# EAGLE design mainboard (EAGLE 8.3.2)
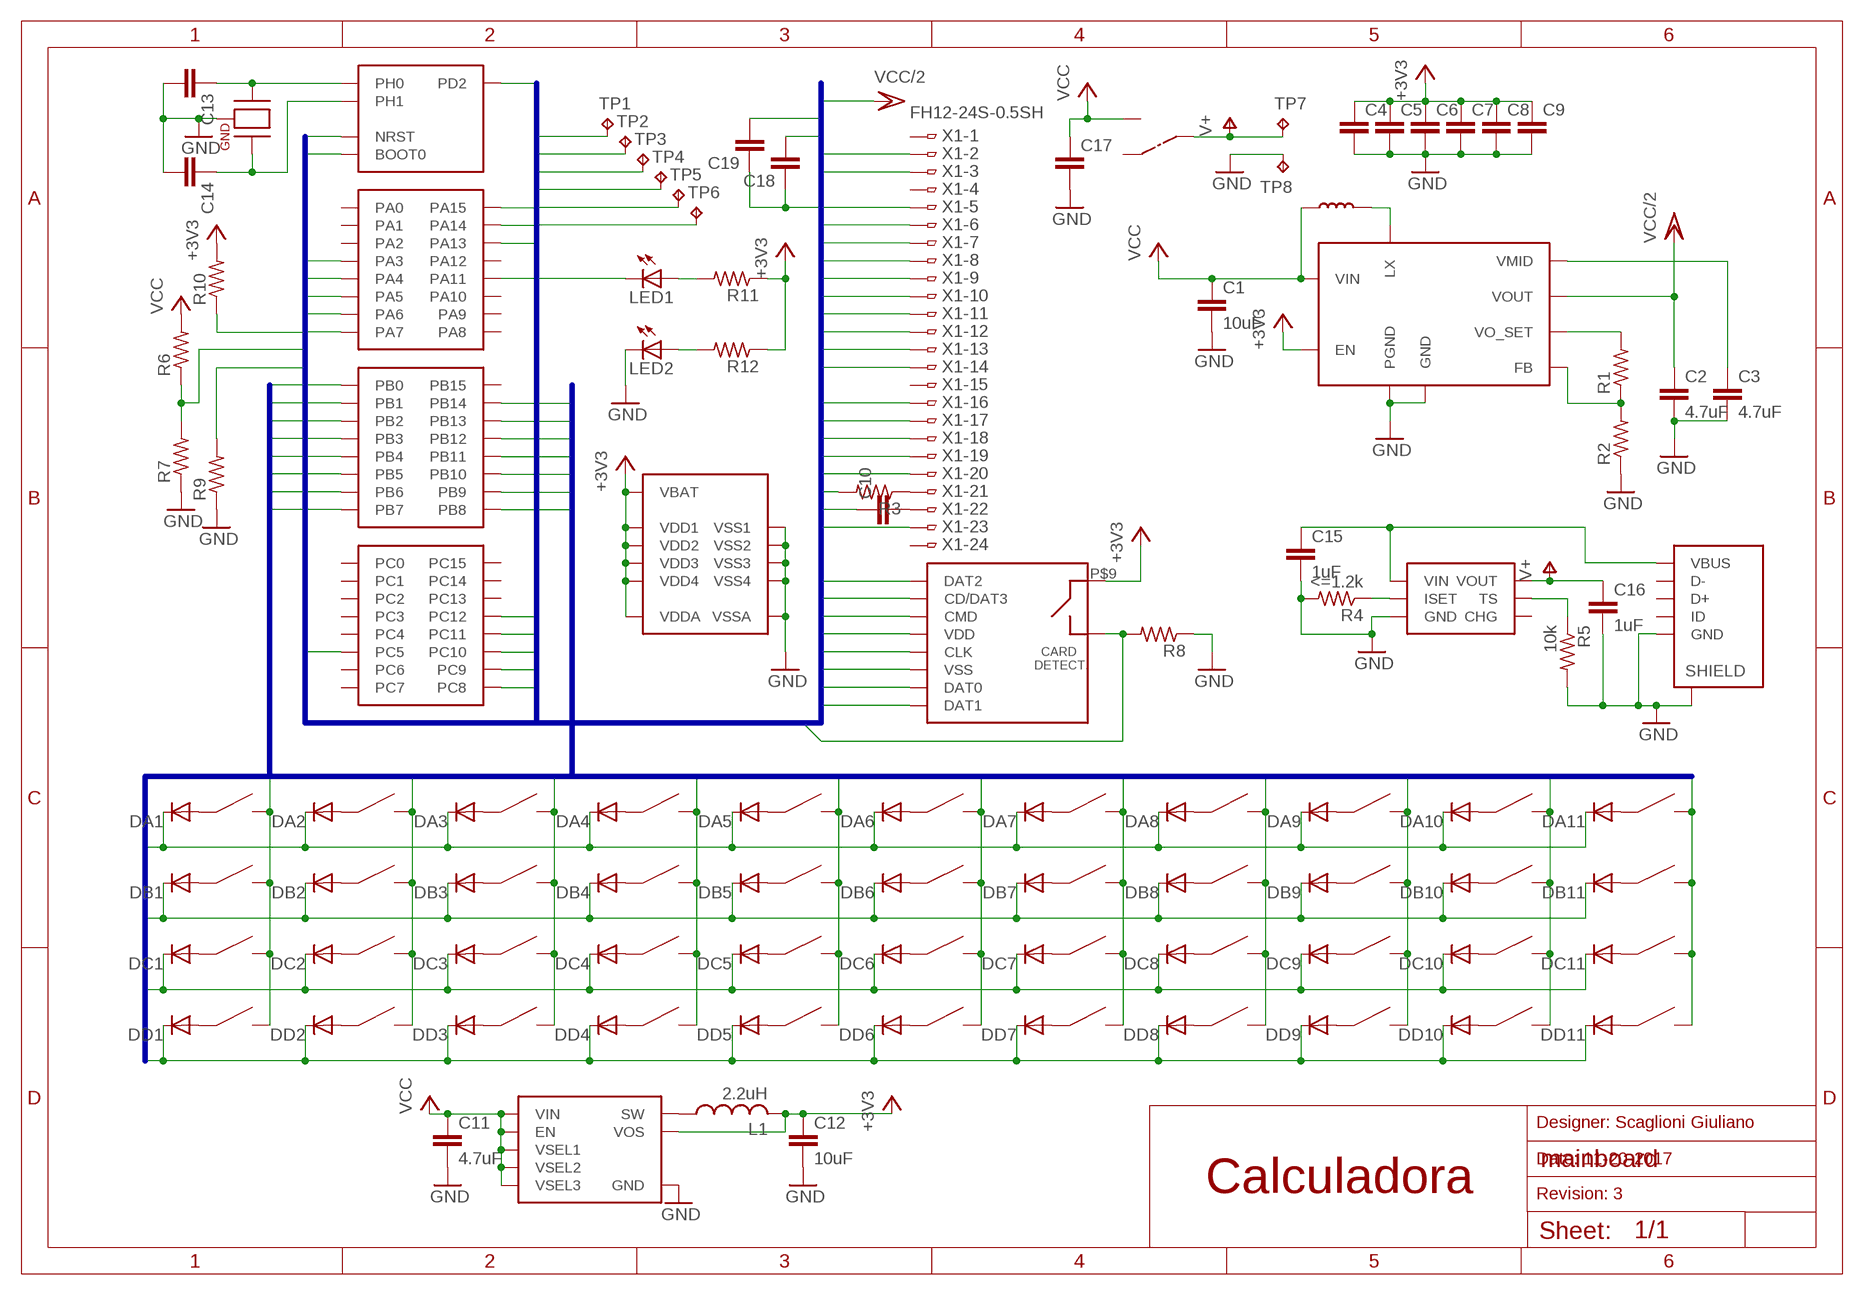
[diagram p0: schematic, sheet 1]

## Parts
BTA1  WURTH_SWITCH  [WURTH_SWITCH_SMD]
BTA2  WURTH_SWITCH  [WURTH_SWITCH_SMD]
BTA3  WURTH_SWITCH  [WURTH_SWITCH_SMD]
BTA4  WURTH_SWITCH  [WURTH_SWITCH_SMD]
BTA5  WURTH_SWITCH  [WURTH_SWITCH_SMD]
BTA6  WURTH_SWITCH  [WURTH_SWITCH_SMD]
BTA7  WURTH_SWITCH  [WURTH_SWITCH_SMD]
BTA8  WURTH_SWITCH  [WURTH_SWITCH_SMD]
BTA9  WURTH_SWITCH  [WURTH_SWITCH_SMD]
BTA10  WURTH_SWITCH  [WURTH_SWITCH_SMD]
BTA11  WURTH_SWITCH  [WURTH_SWITCH_SMD]
BTB1  WURTH_SWITCH  [WURTH_SWITCH_SMD]
BTB2  WURTH_SWITCH  [WURTH_SWITCH_SMD]
BTB3  WURTH_SWITCH  [WURTH_SWITCH_SMD]
BTB4  WURTH_SWITCH  [WURTH_SWITCH_SMD]
BTB5  WURTH_SWITCH  [WURTH_SWITCH_SMD]
BTB6  WURTH_SWITCH  [WURTH_SWITCH_SMD]
BTB7  WURTH_SWITCH  [WURTH_SWITCH_SMD]
BTB8  WURTH_SWITCH  [WURTH_SWITCH_SMD]
BTB9  WURTH_SWITCH  [WURTH_SWITCH_SMD]
BTB10  WURTH_SWITCH  [WURTH_SWITCH_SMD]
BTB11  WURTH_SWITCH  [WURTH_SWITCH_SMD]
BTC1  WURTH_SWITCH  [WURTH_SWITCH_SMD]
BTC2  WURTH_SWITCH  [WURTH_SWITCH_SMD]
BTC3  WURTH_SWITCH  [WURTH_SWITCH_SMD]
BTC4  WURTH_SWITCH  [WURTH_SWITCH_SMD]
BTC5  WURTH_SWITCH  [WURTH_SWITCH_SMD]
BTC6  WURTH_SWITCH  [WURTH_SWITCH_SMD]
BTC7  WURTH_SWITCH  [WURTH_SWITCH_SMD]
BTC8  WURTH_SWITCH  [WURTH_SWITCH_SMD]
BTC9  WURTH_SWITCH  [WURTH_SWITCH_SMD]
BTC10  WURTH_SWITCH  [WURTH_SWITCH_SMD]
BTC11  WURTH_SWITCH  [WURTH_SWITCH_SMD]
BTD1  WURTH_SWITCH  [WURTH_SWITCH_SMD]
BTD2  WURTH_SWITCH  [WURTH_SWITCH_SMD]
BTD3  WURTH_SWITCH  [WURTH_SWITCH_SMD]
BTD4  WURTH_SWITCH  [WURTH_SWITCH_SMD]
BTD5  WURTH_SWITCH  [WURTH_SWITCH_SMD]
BTD6  WURTH_SWITCH  [WURTH_SWITCH_SMD]
BTD7  WURTH_SWITCH  [WURTH_SWITCH_SMD]
BTD8  WURTH_SWITCH  [WURTH_SWITCH_SMD]
BTD9  WURTH_SWITCH  [WURTH_SWITCH_SMD]
BTD10  WURTH_SWITCH  [WURTH_SWITCH_SMD]
BTD11  WURTH_SWITCH  [WURTH_SWITCH_SMD]
C1  10uF  C-EUC0805  [C0805]
C2  4.7uF  C-EUC0805  [C0805]
C3  4.7uF  C-EUC0805  [C0805]
C4  C-EUC0603  [C0603]
C5  C-EUC0603  [C0603]
C6  C-EUC0603  [C0603]
C7  C-EUC0603  [C0603]
C8  C-EUC0603  [C0603]
C9  C-EUC0603  [C0603]
C10  C-EUC0603  [C0603]
C11  4.7uF  C-EUC0603  [C0603]
C12  10uF  C-EUC0603  [C0603]
C13  CC0603  [C0603]
C14  CC0603  [C0603]
C15  1uF  C-EUC0603  [C0603]
C16  1uF  C-EUC0603  [C0603]
C17  CC1206  [C1206]
C18  C-EUC0603  [C0603]
C19  C-EUC0603  [C0603]
DA1  DIODE-SOD523  [SOD523]
DA2  DIODE-SOD523  [SOD523]
DA3  DIODE-SOD523  [SOD523]
DA4  DIODE-SOD523  [SOD523]
DA5  DIODE-SOD523  [SOD523]
DA6  DIODE-SOD523  [SOD523]
DA7  DIODE-SOD523  [SOD523]
DA8  DIODE-SOD523  [SOD523]
DA9  DIODE-SOD523  [SOD523]
DA10  DIODE-SOD523  [SOD523]
DA11  DIODE-SOD523  [SOD523]
DB1  DIODE-SOD523  [SOD523]
DB2  DIODE-SOD523  [SOD523]
DB3  DIODE-SOD523  [SOD523]
DB4  DIODE-SOD523  [SOD523]
DB5  DIODE-SOD523  [SOD523]
DB6  DIODE-SOD523  [SOD523]
DB7  DIODE-SOD523  [SOD523]
DB8  DIODE-SOD523  [SOD523]
DB9  DIODE-SOD523  [SOD523]
DB10  DIODE-SOD523  [SOD523]
DB11  DIODE-SOD523  [SOD523]
DC1  DIODE-SOD523  [SOD523]
DC2  DIODE-SOD523  [SOD523]
DC3  DIODE-SOD523  [SOD523]
DC4  DIODE-SOD523  [SOD523]
DC5  DIODE-SOD523  [SOD523]
DC6  DIODE-SOD523  [SOD523]
DC7  DIODE-SOD523  [SOD523]
DC8  DIODE-SOD523  [SOD523]
DC9  DIODE-SOD523  [SOD523]
DC10  DIODE-SOD523  [SOD523]
DC11  DIODE-SOD523  [SOD523]
DD1  DIODE-SOD523  [SOD523]
DD2  DIODE-SOD523  [SOD523]
DD3  DIODE-SOD523  [SOD523]
DD4  DIODE-SOD523  [SOD523]
DD5  DIODE-SOD523  [SOD523]
DD6  DIODE-SOD523  [SOD523]
DD7  DIODE-SOD523  [SOD523]
DD8  DIODE-SOD523  [SOD523]
DD9  DIODE-SOD523  [SOD523]
DD10  DIODE-SOD523  [SOD523]
DD11  DIODE-SOD523  [SOD523]
L1  2.2uH  L-USL2012C  [L2012C]
LED1  LED_ESML0603  [LED_SML0603]
LED2  LED_ESML0603  [LED_SML0603]
R1  R-US_R0402  [R0402]
R2  R-US_R0402  [R0402]
R3  R-US_R0402  [R0402]
R4  <=1.2k  R-US_R0402  [R0402]
R5  10k  R-US_R0402  [R0402]
R6  R-US_R0402  [R0402]
R7  R-US_R0402  [R0402]
R8  R-US_R0402  [R0402]
R9  R-US_R0402  [R0402]
R10  R-US_R0402  [R0402]
R11  R-US_R0402  [R0402]
R12  R-US_R0402  [R0402]
TP1  TPTP20SQ  [TP20SQ]
TP2  TPTP20SQ  [TP20SQ]
TP3  TPTP20SQ  [TP20SQ]
TP4  TPTP20SQ  [TP20SQ]
TP5  TPTP20SQ  [TP20SQ]
TP6  TPTP20SQ  [TP20SQ]
TP7  TPTP20SQ  [TP20SQ]
TP8  TPTP20SQ  [TP20SQ]
U$1  STM32L471RGT6  [LQFP64]
U$2  DM3AT-SF-PEJM5  [DM3AT-SF-PEJM5_MICROSDREADER]
U$3  MOLEX_47346-1001  [MOLEX_47346-1001]
U$4  STOD1317BTPUR  [DFN12L]
U$5  VLS252010HBU  [VLS252010HBU]
U$6  TPS627431YFPR  [BGA8]
U$7  CX5032SA  [CRYSTAL_5X3.2]
U$8  BQ21040DBVR  [6-SOT-23]
U$9  ALPS_SSSS810701  [ALPS_SSSS810701]
X1  FH12-24S-0.5SH  [FH12-24S-0.5SH]

## Nets
+3V3: C4.1 C5.1 C6.1 C7.1 C8.1 C9.1 C12.1 C18.2 L1.2 R10.2 R11.1 R12.1 TP1.TP U$1.P$1(VBAT) U$1.P$13(VDDA) U$1.P$19(VDD1) U$1.P$32(VDD2) U$1.P$48(VDD3) U$1.P$64(VDD4) U$2.P$4(VDD) U$2.P$9 U$4.P6(EN) U$6.C2(VOS) X1.5 X1.9
BAT_SENS: R6.1 R7.2 U$1.P$25(PC5)
BOOT0: R9.2 TP5.TP U$1.P$60(BOOT0)
GND: C1.2 C2.2 C3.2 C4.2 C5.2 C6.2 C7.2 C8.2 C9.2 C10.1 C11.2 C12.2 C13.2 C14.2 C15.2 C16.2 C17.2 C18.1 C19.1 LED2.C R2.1 R3.2 R4.2 R5.2 R7.1 R8.1 R9.1 TP4.TP TP8.TP U$1.P$12(VSSA) U$1.P$18(VSS1) U$1.P$31(VSS2) U$1.P$47(VSS3) U$1.P$63(VSS4) U$2.P$6(VSS) U$3.MECH1 U$3.MECH2 U$3.MECH3 U$3.MECH4 U$3.MECH5 U$3.MECH6 U$3.P$5(GND) U$4.P4(GND) U$4.P9(PGND) U$4.P10(PGND) U$6.B2(GND) U$7.P$2(GND) U$7.P$4(GND) U$8.P$5(GND) X1.2 X1.3 X1.6 X1.7 X1.11 X1.12 X1.16 X1.17 X1.18 X1.19 X1.20
KEYCOL0: BTA1.P$2 BTA1.P$4 BTB1.P$2 BTB1.P$4 BTC1.P$2 BTC1.P$4 BTD1.P$2 BTD1.P$4 U$1.P$26(PB0)
KEYCOL1: BTA2.P$2 BTA2.P$4 BTB2.P$2 BTB2.P$4 BTC2.P$2 BTC2.P$4 BTD2.P$2 BTD2.P$4 U$1.P$27(PB1)
KEYCOL2: BTA3.P$2 BTA3.P$4 BTB3.P$2 BTB3.P$4 BTC3.P$2 BTC3.P$4 BTD3.P$2 BTD3.P$4 U$1.P$28(PB2)
KEYCOL3: BTA4.P$2 BTA4.P$4 BTB4.P$2 BTB4.P$4 BTC4.P$2 BTC4.P$4 BTD4.P$2 BTD4.P$4 U$1.P$55(PB3)
KEYCOL4: BTA5.P$2 BTA5.P$4 BTB5.P$2 BTB5.P$4 BTC5.P$2 BTC5.P$4 BTD5.P$2 BTD5.P$4 U$1.P$56(PB4)
KEYCOL5: BTA6.P$2 BTA6.P$4 BTB6.P$2 BTB6.P$4 BTC6.P$2 BTC6.P$4 BTD6.P$2 BTD6.P$4 U$1.P$57(PB5)
KEYCOL6: BTA7.P$2 BTA7.P$4 BTB7.P$2 BTB7.P$4 BTC7.P$2 BTC7.P$4 BTD7.P$2 BTD7.P$4 U$1.P$58(PB6)
KEYCOL7: BTA8.P$2 BTA8.P$4 BTB8.P$2 BTB8.P$4 BTC8.P$2 BTC8.P$4 BTD8.P$2 BTD8.P$4 U$1.P$59(PB7)
KEYCOL8: BTA9.P$2 BTA9.P$4 BTB9.P$2 BTB9.P$4 BTC9.P$2 BTC9.P$4 BTD9.P$2 BTD9.P$4 U$1.P$61(PB8)
KEYCOL9: BTA10.P$2 BTA10.P$4 BTB10.P$2 BTB10.P$4 BTC10.P$2 BTC10.P$4 BTD10.P$2 BTD10.P$4 U$1.P$62(PB9)
KEYCOL10: BTA11.P$2 BTA11.P$4 BTB11.P$2 BTB11.P$4 BTC11.P$2 BTC11.P$4 BTD11.P$2 BTD11.P$4 U$1.P$29(PB10)
KEYROW0: DA1.C DA2.C DA3.C DA4.C DA5.C DA6.C DA7.C DA8.C DA9.C DA10.C DA11.C
KEYROW1: DB1.C DB2.C DB3.C DB4.C DB5.C DB6.C DB7.C DB8.C DB9.C DB10.C DB11.C U$1.P$34(PB13)
KEYROW2: DC1.C DC2.C DC3.C DC4.C DC5.C DC6.C DC7.C DC8.C DC9.C DC10.C DC11.C U$1.P$33(PB12)
KEYROW3: DD1.C DD2.C DD3.C DD4.C DD5.C DD6.C DD7.C DD8.C DD9.C DD10.C DD11.C U$1.P$30(PB11) U$1.P$35(PB14)
N$1: U$4.P11(LX) U$4.P12(LX) U$5.P$2
N$2: R1.1 R2.2 U$4.P5(FB)
N$3: R3.1 X1.21
N$4: R1.2 U$4.P3(VO_SET)
N$5: C10.2 X1.22
N$6: C3.1 U$4.P1(VMID)
N$7: L1.1 U$6.A1(SW)
N$8: BTA1.P$1 BTA1.P$3 DA1.A
N$9: BTA2.P$1 BTA2.P$3 DA2.A
N$10: BTA3.P$1 BTA3.P$3 DA3.A
N$11: BTA4.P$1 BTA4.P$3 DA4.A
N$12: BTA5.P$1 BTA5.P$3 DA5.A
N$13: BTA6.P$1 BTA6.P$3 DA6.A
N$14: BTA7.P$1 BTA7.P$3 DA7.A
N$15: BTA8.P$1 BTA8.P$3 DA8.A
N$16: BTA9.P$1 BTA9.P$3 DA9.A
N$17: BTA10.P$1 BTA10.P$3 DA10.A
N$18: BTA11.P$1 BTA11.P$3 DA11.A
N$19: BTB1.P$1 BTB1.P$3 DB1.A
N$20: BTB2.P$1 BTB2.P$3 DB2.A
N$21: BTB3.P$1 BTB3.P$3 DB3.A
N$22: BTB4.P$1 BTB4.P$3 DB4.A
N$23: BTB5.P$1 BTB5.P$3 DB5.A
N$24: BTB6.P$1 BTB6.P$3 DB6.A
N$25: BTB7.P$1 BTB7.P$3 DB7.A
N$26: BTB8.P$1 BTB8.P$3 DB8.A
N$27: BTB9.P$1 BTB9.P$3 DB9.A
N$28: BTB10.P$1 BTB10.P$3 DB10.A
N$29: BTB11.P$1 BTB11.P$3 DB11.A
N$30: BTC1.P$1 BTC1.P$3 DC1.A
N$31: BTC2.P$1 BTC2.P$3 DC2.A
N$32: BTC3.P$1 BTC3.P$3 DC3.A
N$33: BTC4.P$1 BTC4.P$3 DC4.A
N$34: BTC5.P$1 BTC5.P$3 DC5.A
N$35: BTC6.P$1 BTC6.P$3 DC6.A
N$36: BTC7.P$1 BTC7.P$3 DC7.A
N$37: BTC8.P$1 BTC8.P$3 DC8.A
N$38: BTC9.P$1 BTC9.P$3 DC9.A
N$39: BTC10.P$1 BTC10.P$3 DC10.A
N$40: BTC11.P$1 BTC11.P$3 DC11.A
N$41: BTD1.P$1 BTD1.P$3 DD1.A
N$42: BTD2.P$1 BTD2.P$3 DD2.A
N$43: BTD3.P$1 BTD3.P$3 DD3.A
N$44: BTD4.P$1 BTD4.P$3 DD4.A
N$45: BTD5.P$1 BTD5.P$3 DD5.A
N$46: BTD6.P$1 BTD6.P$3 DD6.A
N$47: BTD7.P$1 BTD7.P$3 DD7.A
N$48: BTD8.P$1 BTD8.P$3 DD8.A
N$49: BTD9.P$1 BTD9.P$3 DD9.A
N$50: BTD10.P$1 BTD10.P$3 DD10.A
N$51: BTD11.P$1 BTD11.P$3 DD11.A
N$52: C13.1 U$1.P$5(PH0) U$7.P$1(P1)
N$53: C14.1 U$1.P$6(PH1) U$7.P$3(P2)
N$54: C15.1 U$3.P$1(VBUS) U$8.P$6(VIN)
N$55: R5.1 U$8.P$1(TS)
N$56: R4.1 U$8.P$4(ISET)
N$57: LED1.A R11.2
N$58: LED1.C U$1.P$44(PA11)
N$60: LED2.A R12.2
NRST: R10.1 TP6.TP U$1.P$7(NRST)
PA3: U$1.P$17(PA3) X1.10
PA13: TP2.TP U$1.P$46(PA13)
PA14: TP3.TP U$1.P$49(PA14)
SD_CLK: U$1.P$53(PC12) U$2.P$5(CLK)
SD_CMD: U$1.P$54(PD2) U$2.P$3(CMD)
SD_DAT0: U$1.P$39(PC8) U$2.P$7(DAT0)
SD_DAT1: U$1.P$40(PC9) U$2.P$8(DAT1)
SD_DAT2: U$1.P$51(PC10) U$2.P$1(DAT2)
SD_DAT3: U$1.P$52(PC11) U$2.P$2(CD/DAT3)
SD_SWITCH: R8.2 U$1.P$50(PA15) U$2.P$10
SPI_CS: U$1.P$20(PA4) X1.8
SPI_MISO: U$1.P$22(PA6)
SPI_MOSI: U$1.P$23(PA7) X1.14
SPI_SCK: U$1.P$21(PA5) X1.13
V+: C16.1 TP7.TP U$8.P$2(VOUT) U$9.P$1(COM)
VCC: C1.1 C11.1 C17.1 R6.2 U$4.P8(VIN) U$5.P$1 U$6.A2(VIN) U$6.B1(EN) U$6.C1(VSEL1) U$6.D1(VSEL2) U$6.D2(VSEL3) U$9.P$3(L)
VCC/2: C2.1 C19.2 U$4.P2(VOUT) X1.23
Unconnected: U$1.P$2(PC13) U$1.P$3(PC14) U$1.P$4(PC15) U$1.P$8(PC0) U$1.P$9(PC1) U$1.P$10(PC2) U$1.P$11(PC3) U$1.P$14(PA0) U$1.P$15(PA1) U$1.P$16(PA2) U$1.P$24(PC4) U$1.P$36(PB15) U$1.P$37(PC6) U$1.P$38(PC7) U$1.P$41(PA8) U$1.P$42(PA9) U$1.P$43(PA10) U$1.P$45(PA12) U$3.P$2(D-) U$3.P$3(D+) U$3.P$4(ID) U$8.P$3(CHG) U$9.P$2(R) X1.1 X1.4 X1.15 X1.24

## Buses
SD_CLK,SD_CMD,SD_DAT[0..3],+3V3,GND,SPI_CS,SPI_SCK,SPI_MISO,SPI_MOSI,VCC/2,PA[0..15],PB[0..15],PC[0..15],BOOT0,NRST,BAT_SENS,SD_SWITCH
KEYCOL[0..10],KEYROW[0..3]

## Notes on the sheet
- Designer: Scaglioni Giuliano
- Date: 11-20-2017
- Calculadora
- Revision: 3

## Library data of the parts
BTA1-BTA11 BTB1-BTB11 BTC1-BTC11 BTD1-BTD11 = lib:WURTH_SWITCH
C1-C3 = resistor:C-EU: CAPACITOR, European symbol
C4-C12 C15 C16 C18 C19 = rcl:C-EU: CAPACITOR, European symbol
C13 C14 C17 = eagle-ltspice:C: CAPACITOR, European symbol; SPICEMODEL: NONE; SPICEPREFIX: C
DA1-DA11 DB1-DB11 DC1-DC11 DD1-DD11 = diode:DIODE-: DIODE
L1 = rcl:L-US: INDUCTOR, American symbol
LED1 LED2 = eagle-ltspice:LED_E: LED Source: http://www.osram.convergy.de Source: www.luxeon.com Source: www.kingbright.com; SPICEMODEL: NONE; SPICEPREFIX: D; SPICETYPE: diode
R1-R12 = resistor:R-US_: RESISTOR, American symbol
TP1-TP8 = testpad:TP: Test pad
U$1 = lib:STM32L471RGT6
U$2 = lib:DM3AT-SF-PEJM5: Memory Card Connectors R/A SMT MICROSD CON PUSH-PUSH TOP BRDMNT
U$3 = lib:MOLEX_47346-1001
U$4 = lib:STOD1317BTPUR
U$5 = lib:VLS252010HBU
U$6 = lib:TPS627431YFPR
U$7 = lib:CX5032SA
U$8 = lib:BQ21040DBVR
U$9 = lib:ALPS_SSSS810701
X1 = con-hirose:FH12-24S-0.5S: 0.5mm Pitch Connectors For FPC/FFC Source: Data sheet <http://www.hirose.co.jp/cataloge_hp/e58605370.pdf>; MPN: FH12-24S-0.5SH(55); OC_FARNELL: 1324552; OC_NEWARK: 34M6170

## Net classes
0 default: width 0.152 mm, clearance 0.152 mm

## Board
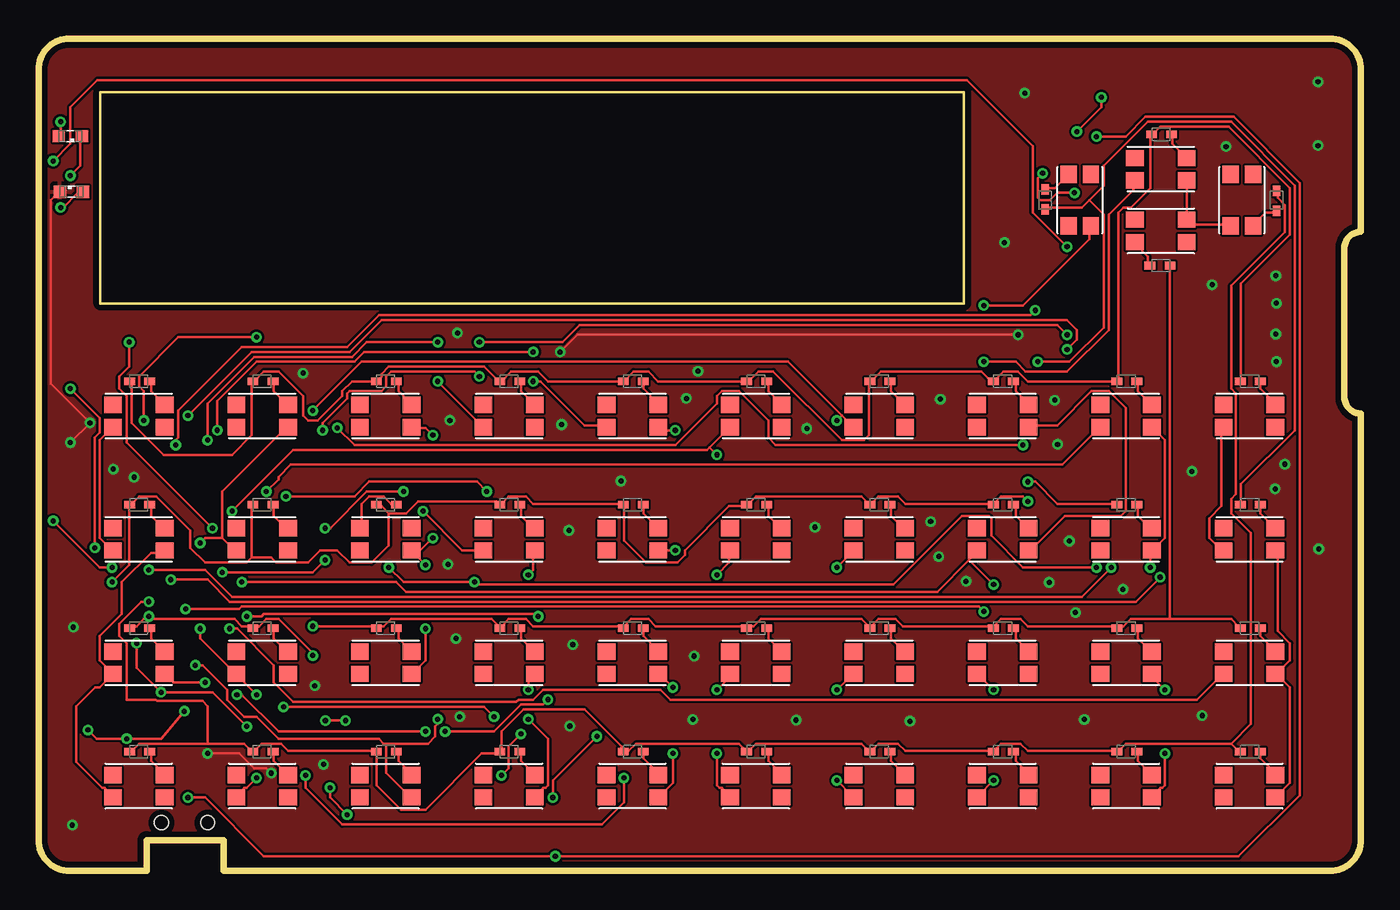
[diagram p1: board, top side]
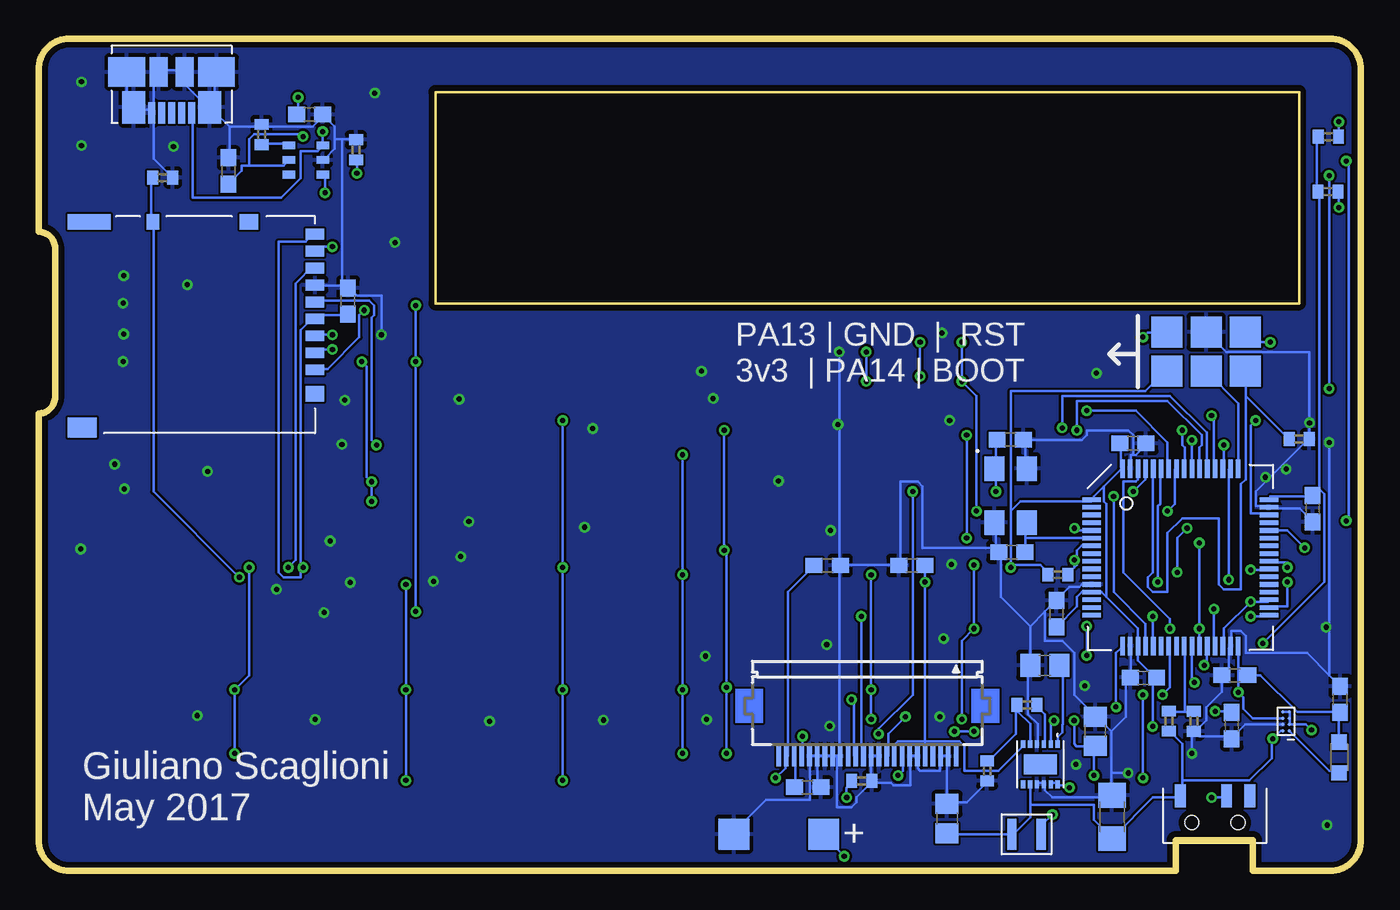
[diagram p2: board, bottom side, seen from below]

Size 85.72 x 53.98 mm. Coordinates in mm from the lower left corner, seen from the top.
Outline: 85.72,51.98 85.72,41.45 arc90 84.65,40.38 84.65,30.73 arc90 85.72,29.66 85.72,2 arc-90 83.72,0 12,0 12,2 7,2 7,0 2,0 arc-90 0,2 0,51.98 arc-90 2,53.98 83.72,53.98 arc-90 85.72,51.98
Outline: 4,50.5 60,50.5 60,36.8 4,36.8 4,50.5
Copper layers (1*16): Top 0.0356mm / dielectric 1.5011mm / Bottom 0.0356mm
Design rules "oshpark-2layer *": minimum track width 6mil, minimum drill 13mil, track to track 6mil, track to pad 6mil, pad to pad 6mil, via to via 6mil, smd to smd 6mil, copper to edge 15mil, drill to drill 6mil, minimum pad ring 7mil, minimum via ring 7mil, stop-mask expansion 0mil, vias tented up to drill 13mil, thermal gap 10mil

### Footprints (pad centres in the part's own frame; a part is rotated, then mirrored left to right if it is on the bottom)
WURTH_SWITCH_SMD = smd 1.15 x 1.05: P$1 -1.675,0.725; P$2 -1.675,-0.725; P$3 1.675,0.725; P$4 1.675,-0.725
C0805 = smd 1.3 x 1.5: 1 -0.95,0; 2 0.95,0
C0603 = smd 1.1 x 1: 1 -0.85,0; 2 0.85,0
C1206 = smd 1.6 x 1.8: 1 -1.4,0; 2 1.4,0
SOD523 = smd 0.7 x 0.5: A 0.7,0; C -0.6,0
L2012C = smd 1 x 1: 1 -1,0; 2 1,0
LED_SML0603 = smd 0.8 x 0.8: A 0.75,0; C -0.75,0
R0402 = smd 0.7 x 0.9: 1 -0.65,0; 2 0.65,0
TP20SQ = smd 2 x 2: TP 0,0
LQFP64 = smd 0.3 x 1.2: P$1 -3.75,-5.75; P$2 -3.25,-5.75; P$3 -2.75,-5.75; P$4 -2.25,-5.75; P$5 -1.75,-5.75; P$6 -1.25,-5.75; P$7 -0.75,-5.75; P$8 -0.25,-5.75; P$9 0.25,-5.75; P$10 0.75,-5.75; P$11 1.25,-5.75; P$12 1.75,-5.75; P$13 2.25,-5.75; P$14 2.75,-5.75; P$15 3.25,-5.75; P$16 3.75,-5.75; P$33 3.75,5.75; P$34 3.25,5.75; P$35 2.75,5.75; P$36 2.25,5.75; P$37 1.75,5.75; P$38 1.25,5.75; P$39 0.75,5.75; P$40 0.25,5.75; P$41 -0.25,5.75; P$42 -0.75,5.75; P$43 -1.25,5.75; P$44 -1.75,5.75; P$45 -2.25,5.75; P$46 -2.75,5.75; P$47 -3.25,5.75; P$48 -3.75,5.75 | smd 1.2 x 0.3: P$17 5.75,-3.75; P$18 5.75,-3.25; P$19 5.75,-2.75; P$20 5.75,-2.25; P$21 5.75,-1.75; P$22 5.75,-1.25; P$23 5.75,-0.75; P$24 5.75,-0.25; P$25 5.75,0.25; P$26 5.75,0.75; P$27 5.75,1.25; P$28 5.75,1.75; P$29 5.75,2.25; P$30 5.75,2.75; P$31 5.75,3.25; P$32 5.75,3.75; P$49 -5.75,3.75; P$50 -5.75,3.25; P$51 -5.75,2.75; P$52 -5.75,2.25; P$53 -5.75,1.75; P$54 -5.75,1.25; P$55 -5.75,0.75; P$56 -5.75,0.25; P$57 -5.75,-0.25; P$58 -5.75,-0.75; P$59 -5.75,-1.25; P$60 -5.75,-1.75; P$61 -5.75,-2.25; P$62 -5.75,-2.75; P$63 -5.75,-3.25; P$64 -5.75,-3.75
DM3AT-SF-PEJM5_MICROSDREADER = smd 1 x 1.2: MECH1 -6.4,3.7; MECH4 4.75,8 | smd 1 x 2.8: MECH2 -6.4,-6.65 | smd 1.3 x 1.9: MECH3 6.95,-7.1 | smd 0.7 x 1.2: P$1 3.2,8; P$2 2.1,8; P$3 1,8; P$4 -0.1,8; P$5 -1.2,8; P$6 -2.3,8; P$7 -3.4,8; P$8 -4.5,8; P$9 -5.6,8 | smd 1 x 0.8: P$10 -6.4,-2.5
MOLEX_47346-1001 = smd 1.9 x 1.175: MECH1 0,0.838; MECH2 0,-0.838 | smd 1.9 x 2.375: MECH3 0,-2.913; MECH4 0,2.913 | smd 2.1 x 1.475: MECH5 2.3,-2.462; MECH6 2.3,2.462 | smd 1.38 x 0.45: P$1 2.66,1.3; P$2 2.66,0.65; P$3 2.66,0; P$4 2.66,-0.65; P$5 2.66,-1.3
DFN12L = smd 0.28 x 0.5: P1 -1.125,-1.3; P2 -0.675,-1.3; P3 -0.225,-1.3; P4 0.225,-1.3; P5 0.675,-1.3; P6 1.125,-1.3; P7 1.125,1.3; P8 0.675,1.3; P9 0.225,1.3; P10 -0.225,1.3; P11 -0.675,1.3; P12 -1.125,1.3 | smd 2.12 x 1.31: TERM 0,0
VLS252010HBU = smd 0.6 x 2: P$1 -0.95,0; P$2 0.95,0
BGA8 = smd 0.23 x 0.23: A1 0.2,-0.6; A2 -0.2,-0.6; B1 0.2,-0.2; B2 -0.2,-0.2; C1 0.2,0.2; C2 -0.2,0.2; D1 0.2,0.6; D2 -0.2,0.6
CRYSTAL_5X3.2 = smd 1.6 x 1.3: P$1 -1.75,-1.05; P$2 1.75,-1.05; P$3 1.75,1.05; P$4 -1.75,1.05
6-SOT-23 = smd 0.5 x 0.8: P$1 -0.95,-1.1; P$2 0,-1.1; P$3 0.95,-1.1; P$4 0.95,1.1; P$5 0,1.1; P$6 -0.95,1.1
ALPS_SSSS810701 = smd 0.7 x 1.5: P$1 0.75,1.75; P$2 2.25,1.75; P$3 -2.25,1.75 | hole 0.9: -1.5,0; 1.5,0
FH12-24S-0.5SH = smd 0.3 x 1.3: 1 -5.75,3.25; 2 -5.25,3.25; 3 -4.75,3.25; 4 -4.25,3.25; 5 -3.75,3.25; 6 -3.25,3.25; 7 -2.75,3.25; 8 -2.25,3.25; 9 -1.75,3.25; 10 -1.25,3.25; 11 -0.75,3.25; 12 -0.25,3.25; 13 0.25,3.25; 14 0.75,3.25; 15 1.25,3.25; 16 1.75,3.25; 17 2.25,3.25; 18 2.75,3.25; 19 3.25,3.25; 20 3.75,3.25; 21 4.25,3.25; 22 4.75,3.25; 23 5.25,3.25; 24 5.75,3.25

### Placement (x,y rotation side)
BTA1  6.5,29.5 0 top
BTA2  14.5,29.5 0 top
BTA3  22.5,29.5 0 top
BTA4  30.5,29.5 0 top
BTA5  38.5,29.5 0 top
BTA6  46.5,29.5 0 top
BTA7  54.5,29.5 0 top
BTA8  62.5,29.5 0 top
BTA9  70.5,29.5 0 top
BTA10  78.5,29.5 0 top
BTA11  72.75,45.5 0 top
BTB1  6.5,21.5 0 top
BTB2  14.5,21.5 0 top
BTB3  22.5,21.5 0 top
BTB4  30.5,21.5 0 top
BTB5  38.5,21.5 0 top
BTB6  46.5,21.5 0 top
BTB7  54.5,21.5 0 top
BTB8  62.5,21.5 0 top
BTB9  70.5,21.5 0 top
BTB10  78.5,21.5 0 top
BTB11  67.5,43.5 90 top
BTC1  6.5,13.5 0 top
BTC2  14.5,13.5 0 top
BTC3  22.5,13.5 0 top
BTC4  30.5,13.5 0 top
BTC5  38.5,13.5 0 top
BTC6  46.5,13.5 0 top
BTC7  54.5,13.5 0 top
BTC8  62.5,13.5 0 top
BTC9  70.5,13.5 0 top
BTC10  78.5,13.5 0 top
BTC11  72.75,41.5 180 top
BTD1  6.5,5.5 0 top
BTD2  14.5,5.5 0 top
BTD3  22.5,5.5 0 top
BTD4  30.5,5.5 0 top
BTD5  38.5,5.5 0 top
BTD6  46.5,5.5 0 top
BTD7  54.5,5.5 0 top
BTD8  62.5,5.5 0 top
BTD9  70.5,5.5 0 top
BTD10  78.5,5.5 0 top
BTD11  78,43.5 270 top
C1  26.83,3.4 90 bottom
C2  17.22,9.06 90 bottom
C3  20.49,13.33 180 bottom
C4  3.12,23.49 270 bottom
C5  14.1,12.54 180 bottom
C6  8.17,12.7 180 bottom
C7  19.74,16.68 90 bottom
C8  14.78,27.73 0 bottom
C9  65.67,36.96 90 bottom
C10  35.86,5.44 180 bottom
C11  8.38,9.42 270 bottom
C12  1.35,11.13 90 bottom
C13  22.73,27.97 0 bottom
C14  22.63,20.68 180 bottom
C15  68.15,49.05 0 bottom
C16  73.41,45.39 90 bottom
C17  16.14,3.51 90 bottom
C18  29.11,19.81 0 bottom
C19  34.59,19.81 180 bottom
DA1  6.5,31.75 0 top
DA2  14.5,31.75 0 top
DA3  22.5,31.75 0 top
DA4  30.5,31.75 0 top
DA5  38.5,31.75 0 top
DA6  46.5,31.75 0 top
DA7  54.5,31.75 0 top
DA8  62.5,31.75 0 top
DA9  70.5,31.75 0 top
DA10  78.5,31.75 0 top
DA11  72.75,47.75 0 top
DB1  6.5,23.75 0 top
DB2  14.5,23.75 0 top
DB3  22.5,23.75 0 top
DB4  30.5,23.75 0 top
DB5  38.5,23.75 0 top
DB6  46.5,23.75 0 top
DB7  54.5,23.75 0 top
DB8  62.5,23.75 0 top
DB9  70.5,23.75 0 top
DB10  78.5,23.75 0 top
DB11  65.25,43.5 90 top
DC1  6.5,15.75 0 top
DC2  14.5,15.75 0 top
DC3  22.5,15.75 0 top
DC4  30.5,15.75 0 top
DC5  38.5,15.75 0 top
DC6  46.5,15.75 0 top
DC7  54.5,15.75 0 top
DC8  62.5,15.75 0 top
DC9  70.5,15.75 0 top
DC10  78.5,15.75 0 top
DC11  72.75,39.25 180 top
DD1  6.5,7.75 0 top
DD2  14.5,7.75 0 top
DD3  22.5,7.75 0 top
DD4  30.5,7.75 0 top
DD5  38.5,7.75 0 top
DD6  46.5,7.75 0 top
DD7  54.5,7.75 0 top
DD8  62.5,7.75 0 top
DD9  70.5,7.75 0 top
DD10  78.5,7.75 0 top
DD11  80.25,43.5 270 top
L1  1.42,7.37 90 bottom
LED1  2.06,47.65 180 top
LED2  2.13,44.04 0 top
R1  21.65,10.77 0 bottom
R2  24.23,6.49 90 bottom
R3  32.36,5.84 0 bottom
R4  65.15,46.76 90 bottom
R5  71.27,47.75 90 bottom
R6  12.46,9.72 270 bottom
R7  10.83,9.71 90 bottom
R8  77.68,44.96 180 bottom
R9  4,28 180 bottom
R10  19.65,19.21 180 bottom
R11  2.11,47.62 0 bottom
R12  2.13,44.04 0 bottom
TP1  12.57,32.41 0 bottom
TP2  12.57,34.95 0 bottom
TP3  10.03,32.41 0 bottom
TP4  10.03,34.95 0 bottom
TP5  7.49,32.41 0 bottom
TP6  7.49,34.95 0 bottom
TP7  34.82,2.39 0 bottom
TP8  40.64,2.39 0 bottom
U$1  11.71,20.33 270 bottom
U$2  75.8,35.7 270 bottom
U$3  77.1,51.81 270 bottom
U$4  20.78,6.92 180 bottom
U$5  21.68,2.38 0 bottom
U$6  4.85,9.7 0 bottom
U$7  22.71,24.33 270 bottom
U$8  68.4,46.1 270 bottom
U$9  9.46,3.13 0 bottom
X1  32,10.7 180 bottom

### Tracks (layer width: path | path; a pad name or v marks a point on that pad's centre or on a via)
+3V3  (via drill 0.33)
  Top 0.152: v13.49,9.37 11.27,11.59 v7.94,11.59 6.35,13.18 v6.35,14.76 | v22.7,19.68 23.65,18.73 v28.26,18.73 28.42,18.57 55.4,18.57 59.85,23.02 61.59,23.02 61.75,22.86 61.75,21.75 63.82,19.68 v68.58,19.68
  Bottom 0.152: R11.1 2.86,47.62 2.86,44.13 R12.1 2.7,43.97 2.7,24.77 | C4.1 3.17,24.29 5.87,24.29 5.87,24.13 U$1.P$48 | 2.7,24.77 3.02,24.45 C4.1 | C9.1 65.72,36.04 67.79,36.04 67.79,35.88 U$2.P$4 67.94,35.88 68.74,35.08 68.74,19.68 | 68.74,19.68 68.74,19.05 69.85,19.05 70.17,19.37 70.17,40.8 68.42,40.8 67.94,41.27 U$2.P$9 | 28.26,8.41 26.04,8.41 25.72,8.1 25.72,6.51 23.5,6.51 21.91,8.1 U$4.P6 | 28.26,8.41 28.26,7.46 X1.5 | 28.26,8.41 v28.26,18.73 28.26,19.68 C18.2 | 28.26,8.41 30,8.41 30.16,8.26 30.16,7.46 X1.9 | L1.2 1.43,8.41 1.43,10.16 C12.1 1.43,10.32 4.13,10.32 6.51,12.7 C6.1 7.46,12.7 7.94,13.18 | 7.94,13.18 7.94,14.45 U$1.P$32 | 13.49,12.7 14.45,13.65 14.45,14.45 U$1.P$19 14.45,14.61 14.45,15.72 16.51,17.78 | 13.49,12.7 13.34,12.54 C5.1 13.49,12.7 | C7.1 19.68,15.88 18.41,17.14 18.41,17.78 18.1,18.1 17.46,18.1 U$1.P$13 17.3,18.1 16.83,18.1 16.51,17.78 | C8.1 15.56,27.62 15.56,26.19 U$1.P$64 15.56,26.04 16.67,24.92 | 22.7,19.84 20.8,19.84 20.32,19.37 R10.2 | 22.7,23.34 22.7,19.84 | 22.7,23.34 22.07,23.97 17.46,23.97 U$1.P$1 17.3,24.13 17.3,24.29 16.67,24.92 | 22.7,23.34 22.7,31.11 13.97,31.11 12.7,32.38 TP1.TP | 16.51,17.78 16.51,23.81 16.67,23.97 16.67,24.92 | 7.94,13.18 v7.94,11.59 7.62,11.27 7.62,10.52 7.01,9.9 U$6.C2 | 13.49,12.7 v13.49,9.37 | 22.7,19.84 v22.7,19.68 | v68.58,19.68 68.74,19.68 | 2.7,24.77 2.38,24.45 2.38,18.73 v6.35,14.76 | 2.7,24.77 C4.1
BAT_SENS
  Bottom 0.152: 11.43,10.32 12.38,10.32 R6.1 | 11.43,10.32 10.95,10.32 R7.2 | 11.43,10.32 11.43,14.45 U$1.P$25
BOOT0
  Bottom 0.152: 7.46,30.8 4.76,28.1 R9.2 | 7.46,30.8 7.46,32.38 TP5.TP | 7.46,30.8 7.46,25.4 7.78,25.08 7.78,18.26 8.89,18.26 9.21,18.57 9.21,22.86 11.59,22.86 12.54,21.91 12.54,18.1 13.49,18.1 13.81,18.41 13.81,19.05 13.49,19.37 13.49,26.04 U$1.P$60
GND  (via drill 0.33, 0.33 pad 0.69)
  Top 0.152: LED2.C 1.27,43.97 0.79,43.5 0.79,31.59 v3.33,29.05 v2.06,27.78 | v63.5,34.77 34.92,34.77 v33.81,33.66 | v10.95,7.62 13.02,7.62 13.97,6.67 14.76,6.67 v15.08,6.35
  Bottom 0.152: 5.08,9.53 U$6.B2 7.48,9.5 8.26,8.73 C11.2 8.41,8.73 10.48,8.73 10.78,9.03 | 10.78,9.03 10.79,9.05 R7.1 10.95,9.05 v10.95,7.62 | 2.06,12.7 3.49,14.13 7.46,14.13 7.46,15.24 7.78,15.56 8.41,15.56 8.41,14.61 U$1.P$31 8.57,14.45 8.57,13.02 8.89,12.7 C6.2 | 2.06,12.7 1.43,12.06 C12.2 | 9.21,12.54 9.05,12.7 C6.2 | C4.2 3.17,22.7 3.97,23.5 5.87,23.5 U$1.P$47 6.03,23.65 6.83,23.65 6.83,24.61 3.49,27.94 R9.1 3.33,28.1 v3.33,29.05 3.33,33.66 8.73,33.66 10,34.92 TP4.TP | v2.06,27.78 2.06,12.7 | U$1.P$18 14.92,14.45 14.92,12.54 C5.2 15.08,12.38 15.24,12.22 15.24,10 16.19,9.05 | U$4.P9 20.95,5.71 20.64,5.71 U$4.P10 20.48,5.56 20.48,5.24 20,4.76 16.19,4.76 C17.2 16.19,4.92 16.19,6.35 | 16.19,9.05 17.14,10 C2.2 17.3,10.16 18.57,11.43 18.57,14.13 19.37,14.92 20.48,14.92 20.48,16.83 | 16.19,6.35 16.19,9.05 | U$1.P$12 18.1,18.57 18.26,18.41 18.89,18.41 19.68,17.62 C7.2 19.84,17.46 20.48,16.83 | U$4.P4 20.95,8.26 20.95,9.53 21.59,10.16 21.59,13.18 C3.2 21.43,15.88 | 21.43,15.88 20.48,16.83 | 14.76,26.99 14.92,26.99 14.92,26.19 U$1.P$63 | 14.76,26.99 14.61,26.99 13.97,27.62 C8.2 | 21.75,27.94 21.75,26.19 U$7.P$4 | 23.65,20.95 23.5,20.8 C14.2 | 23.65,20.95 23.65,22.54 U$7.P$2 | 14.76,26.99 14.76,28.26 15.08,28.57 17.78,28.57 17.78,28.26 18.1,27.94 21.75,27.94 | 21.75,27.94 C13.2 | 21.43,15.88 23.34,17.78 23.34,20.64 C14.2 | 66.04,37.94 67.79,37.94 U$2.P$6 | 66.04,37.94 65.72,37.94 C9.2 | 66.52,47.47 66.52,48.26 67.15,48.9 C15.2 67.31,48.9 67.94,48.26 71.12,48.26 R5.2 71.28,48.26 73.34,48.26 | 66.52,47.47 66.52,46.83 67.15,46.2 U$8.P$5 | 66.52,47.47 66.04,47.47 | 66.04,47.47 65.25,47.47 R4.2
  Bottom 0.152: 66.04,47.47 66.04,37.94 | 66.04,37.94 C9.2 | 73.34,48.26 73.34,46.35 C16.2 | 74.3,49.85 74.61,49.53 U$3.MECH6 | 74.3,49.85 74.3,51.75 U$3.MECH4 | 73.34,48.26 74.3,49.21 74.3,49.85 | 74.3,49.85 U$3.MECH6 | U$3.MECH3 80.01,51.75 80.01,49.85 79.69,49.53 U$3.MECH5 79.53,49.37 78.42,49.37 78.42,49.21 U$3.P$5 | R8.1 77.15,45.09 78.26,46.2 78.26,49.05 U$3.P$5 | U$3.P$5 78.26,49.21 78.26,51.44 77.95,51.75 U$3.MECH2 77.79,51.91 76.36,51.91 U$3.MECH1 76.2,51.75 76.2,50.96 74.77,49.53 U$3.MECH6 | R3.2 31.75,5.87 X1.12 31.75,7.46 31.27,7.46 X1.11 | R2.1 24.29,5.71 25.56,4.45 26.67,4.45 C1.2 26.83,4.45 26.83,7.3 X1.2 26.83,7.46 27.15,7.46 X1.3 27.3,7.3 27.3,6.51 28.57,6.51 28.73,6.67 28.73,7.3 X1.6 28.89,7.46 29.21,7.46 X1.7 29.21,7.3 29.21,5.56 30.32,5.56 30.48,5.71 31.59,5.71 R3.2 | C19.1 33.66,19.84 30,19.84 C18.1 29.84,19.84 29.84,25.24 28.73,25.24 28.42,24.92 28.42,20.95 23.65,20.95 | 33.97,7.46 34.13,7.46 X1.17 34.29,7.46 34.61,7.46 X1.18 34.77,7.46 35.24,7.46 | 33.97,7.46 33.81,7.46 | C10.1 35.08,5.56 35.24,5.71 35.24,7.3 X1.19 35.24,7.46 | 35.24,7.46 35.72,7.46 X1.20 35.72,7.3 35.72,4.6 38.58,4.6 40.64,2.54 TP8.TP | 33.81,7.46 33.81,19.68 C19.1 | 33.81,7.46 X1.16 | 33.97,7.46 33.97,4.13 33.02,4.13 32.7,4.45 32.7,4.76 31.75,5.71 R3.2 | v63.5,34.77 63.5,37.31 65.09,37.31 65.56,37.78 C9.2 | v33.81,33.66 33.81,19.84 C19.1 | 23.65,20.95 C14.2 | 16.19,6.35 v15.08,6.35 | 10.78,9.03 10.03,9.78 10.03,10.6 9.02,11.61 C6.2
  other vias: 37.75,25.29 58.47,30.59 62.62,40.75 63.93,50.44 82.94,51.17 82.94,47.03 76.08,38.02 74.77,25.91 82.99,20.88 75.43,10.08 67.8,9.82 56.49,9.71 49.11,9.78 42.42,9.82 42.49,13.93 34.39,22.08 50.33,22.29 2.25,15.81 2.19,2.98 27.06,15.07 17.91,12.01 26.54,19.89 34.63,14.68 26.66,29.22 33.9,28.95 41.99,30.65 58.35,20.38 65.52,18.71 66.82,21.4 66.06,27.66 80.21,38.6 80.24,36.82 80.21,34.82 80.24,33.03 80.79,26.37 80.17,24.77 67.22,16.76 60.13,18.79 34.44,9.4 27.16,34.89 17.15,32.28 4.85,26.06 27.31,10 18.47,6.91 70.3,18.26 57.83,22.66 65.88,30.53 49.8,28.69 76.98,46.97 42.75,32.41 6.19,25.53
  pour Top: 0,48.9 0,52 arc-90 2,54 82.7,54 83.7,54 arc-90 85.7,52 85.7,3.8 85.7,2 arc-90 83.7,0 80.4,0 4.1,0 2,0 arc-90 0,2
  pour Bottom: 0,2.6 0,52 arc-90 2,54 5.1,54 83.7,54 arc-90 85.7,52 85.7,46.5 85.7,17.8 85.7,2 arc-90 83.7,0 78.4,0 4.1,0 2,0 arc-90 0,2
KEYCOL0  (via drill 0.33)
  Top 0.152: BTB1.P$2 4.76,20.8 3.97,21.59 3.97,27.94 4.76,28.73 BTA1.P$2 | v10.79,12.22 8.73,12.22 8.26,12.7 BTC1.P$4 | BTD1.P$2 4.76,4.92 4.29,5.4 4.13,5.4 2.44,7.09 2.44,10.67 3.68,11.91 3.97,11.91 4.76,12.7 BTC1.P$2 4.76,12.86 3.97,13.65 3.97,15.24 5.4,16.67 5.4,18.73 7.3,20.64 8.1,20.64 BTB1.P$4
  Bottom 0.152: v10.79,12.22 10.95,12.38 10.95,14.45 U$1.P$26
KEYCOL1  (via drill 0.33)
  Top 0.152: 11.91,21.59 12.7,20.8 BTB2.P$2 | 11.91,21.59 11.91,24.61 16.03,28.73 BTA2.P$4 | v10.48,15.72 10.48,15.08 12.7,12.86 BTC2.P$2 12.86,12.7 v14.13,11.43 | v14.13,6.03 13.49,5.4 13.34,5.4 12.86,4.92 BTD2.P$2 | 11.91,21.59 10.79,21.59 v10.48,21.27
  Bottom 0.152: U$1.P$27 10.48,14.61 v10.48,15.72 v10.48,21.27 | v14.13,11.43 v14.13,6.03
KEYCOL2  (via drill 0.33)
  Top 0.152: v25.08,15.72 25.08,13.65 24.29,12.86 BTC3.P$4 | 24.45,20.48 24.29,20.64 BTB3.P$4 24.45,20.48 | 24.45,20.48 v25.08,19.84 | v25.56,28.26 25.08,28.73 24.29,28.73 BTA3.P$4 | 24.45,20.48 v25.56,21.59 | v10.16,13.34 10.64,13.34 12.22,11.75 12.22,11.11 13.34,10 14.13,10 15.56,8.57 22.07,8.57 22.38,8.26 | 22.38,8.26 22.54,8.1 22.54,6.35 24.13,4.76 BTD3.P$4 | v25.88,9.84 25.88,9.53 25.72,9.37 25.72,8.73 25.24,8.26 22.38,8.26
  Bottom 0.152: v25.08,19.84 v25.08,15.72 25.88,14.92 v25.88,9.84 | v25.56,21.59 v25.56,28.26 | v10.16,13.34 10,13.49 10,14.45 U$1.P$28
KEYCOL3  (via drill 0.33)
  Top 0.152: v31.75,9.84 33.02,8.57 33.02,5.56 32.86,5.4 32.7,5.4 32.23,4.92 BTD4.P$4 | v31.75,11.75 31.75,12.38 32.07,12.7 BTC4.P$4 | v31.75,19.21 32.07,19.53 32.07,20.64 BTB4.P$4 | v10.95,27.94 10.95,30.32 13.97,33.34 20.32,33.34 21.27,34.29 v25.88,34.29 | v25.88,31.75 28.73,28.89 BTA4.P$2 | v24.92,23.34 27.46,20.8 28.73,20.8 BTB4.P$2
  Bottom 0.152: v31.75,9.84 v31.75,11.75 v31.75,19.21 | v10.95,27.94 10.95,26.19 U$1.P$55 | v25.88,34.29 v25.88,31.75 24.92,30.8 v24.92,23.34
KEYCOL4  (via drill 0.33)
  Top 0.152: v41.12,7.62 41.12,5.71 40.32,4.92 BTD5.P$4 | v41.12,11.91 40.32,12.7 BTC5.P$4 | v41.27,20.8 40.32,20.8 BTB5.P$4 | v11.59,28.57 11.59,30.48 14.13,33.02 20.48,33.02 21.11,33.66 v32.07,33.66 | v32.07,31.75 32.54,31.75 35.4,28.89 36.67,28.89 BTA5.P$2 | v41.27,28.57 40.48,28.57 40.32,28.73 BTA5.P$4
  Bottom 0.152: v41.12,7.62 v41.12,11.91 41.12,20.64 v41.27,20.8 v41.27,28.57 | v11.59,28.57 11.59,27.62 11.43,27.46 11.43,26.19 U$1.P$56 | v32.07,31.75 v32.07,33.66
KEYCOL5  (via drill 0.33)
  Top 0.152: v43.97,7.62 43.97,5.56 44.13,5.4 44.29,5.4 44.77,4.92 BTD6.P$2 | v43.97,11.75 44.93,12.7 BTC6.P$2 | v43.97,19.21 44.77,20 44.77,20.64 BTB6.P$2 | v12.54,23.34 16.51,27.3 43.34,27.3 43.5,27.46 | 43.5,27.46 44.77,28.73 BTA6.P$2 | 43.5,27.46 v43.97,26.99
  Bottom 0.152: v43.97,7.62 v43.97,11.75 v43.97,19.21 v43.97,26.99 | v12.54,23.34 12.06,23.81 12.06,26.04 U$1.P$57
KEYCOL6  (via drill 0.33)
  Top 0.152: v51.75,5.87 52.7,4.92 BTD7.P$2 | v51.75,11.75 52.7,12.7 BTC7.P$2 | v51.75,19.68 52.7,20.64 BTB7.P$2 | v17.78,29.84 20.95,33.02 48.58,33.02 52.07,29.53 | 52.07,29.53 52.7,28.89 BTA7.P$2 | 52.07,29.53 v51.75,29.21
  Bottom 0.152: v51.75,5.87 v51.75,11.75 v51.75,19.68 v51.75,29.21 | v17.78,29.84 14.61,29.84 12.54,27.78 12.54,26.19 U$1.P$58
KEYCOL7  (via drill 0.33)
  Top 0.152: v61.91,5.87 60.96,4.92 BTD8.P$2 | v61.91,11.75 60.96,12.7 BTC8.P$2 | v13.18,18.73 23.18,18.73 23.81,18.1 58.26,18.1 60.33,20.16 | 60.33,20.16 60.8,20.64 BTB8.P$2 | BTA8.P$4 64.29,28.89 66.04,28.89 68.26,31.11 69.37,31.11 70.48,30 70.48,23.34 70.17,23.02 66.52,23.02 64.29,20.8 BTB8.P$4 | 60.33,20.16 v61.91,18.57
  Bottom 0.152: v61.91,5.87 v61.91,11.75 v61.91,18.57 | v13.18,18.73 13.18,23.65 13.02,23.81 13.02,26.04 U$1.P$59
KEYCOL8  (via drill 0.33)
  Top 0.152: v73.03,7.62 73.03,5.56 72.87,5.4 72.71,5.4 72.23,4.92 BTD9.P$4 | v73.03,11.75 72.07,12.7 BTC9.P$4 | v14.76,24.61 15.56,25.4 15.56,25.56 16.35,26.35 66.36,26.35 68.74,28.73 BTA9.P$2 | BTA9.P$4 72.23,28.73 73.03,27.94 73.03,21.59 72.23,20.8 BTB9.P$4 72.07,20.64 v72.07,19.68
  Bottom 0.152: v73.03,7.62 v73.03,11.75 72.07,12.7 v72.07,19.68 | v14.76,24.61 13.97,25.4 13.97,26.04 U$1.P$61
KEYCOL9  (via drill 0.33)
  Top 0.152: v12.38,15.72 12.86,15.72 15.24,13.34 15.24,12.22 16.51,10.95 30.96,10.95 31.11,11.11 32.07,11.11 32.7,11.75 40.32,11.75 40.96,11.11 75.09,11.11 76.68,12.7 BTC10.P$2 | BTD10.P$4 80.33,4.92 81.12,5.71 81.12,11.91 80.33,12.7 BTC10.P$4 80.33,12.86 81.12,13.65 81.12,14.76 80.33,15.56 80.33,20.64 BTB10.P$4 | BTA10.P$2 76.68,28.73 76.68,23.65 75.88,22.86 75.88,21.59 76.68,20.8 BTB10.P$2
  Bottom 0.152: v12.38,15.72 12.38,16.35 15.4,19.37 15.4,25.24 14.61,25.24 14.45,25.4 14.45,26.04 U$1.P$62
KEYCOL10  (via drill 0.33)
  Top 0.152: BTA11.P$4 74.45,44.77 74.45,42.23 BTC11.P$2 74.45,42.07 74.61,41.91 77.15,41.91 BTD11.P$4 | v9.53,16.99 13.02,16.99 13.18,17.14 60.96,17.14 v61.28,16.83 | v61.28,36.67 63.82,36.67 68.1,40.96 68.1,41.75 BTB11.P$2 | v61.28,33.02 63.34,33.02 63.98,32.38 66.67,32.38 69.37,35.08 69.37,42.55 70.96,44.13 70.96,44.77 BTA11.P$2
  Bottom 0.152: v9.53,16.99 9.53,14.61 U$1.P$29 | v61.28,36.67 v61.28,33.02 v61.28,16.83
KEYROW0
  Top 0.152: DA10.C 77.95,31.75 77.95,38.1 81.12,41.27 81.12,44.29 77.15,48.26 72.71,48.26 72.23,47.78 DA11.C 72.07,47.62 72.07,44.29 70.8,43.02 70.33,43.02 70.01,42.7 70.01,31.75 DA9.C 64.14,31.75 63.5,32.38 62.55,32.38 61.91,31.75 DA8.C 61.75,31.75 61.12,32.38 54.61,32.38 53.98,31.75 DA7.C 53.82,31.75 53.82,28.26 53.5,27.94 52.07,27.94 47.62,32.38 46.67,32.38 46.04,31.75 DA6.C 40.16,31.75 39.53,32.38 38.58,32.38 37.94,31.75 DA5.C 33.02,31.75 32.38,32.38 30.64,32.38 30,31.75 DA4.C 29.84,31.75 28.89,32.7 22.7,32.7 22.23,32.23 22.23,32.07 DA3.C 20.32,31.75 19.68,31.11 19.68,30.8 18.1,29.21 17.46,29.21 17.14,29.53 17.14,30.8 15.56,32.38 14.61,32.38 13.97,31.75 DA2.C 13.81,31.75 13.81,28.26 12.54,26.99 8.1,26.99 6.03,29.05 6.03,31.75 DA1.C
KEYROW1  (via drill 0.33)
  Top 0.152: 68.1,43.5 67.63,43.02 65.41,43.02 DB11.C | 68.1,43.5 69.06,44.45 69.06,45.72 71.91,48.58 77.31,48.58 81.44,44.45 81.44,28.57 77.95,25.08 77.95,23.81 DB10.C | v64.14,25.24 64.61,25.24 66.04,23.81 69.85,23.81 DB9.C | v64.14,23.97 63.82,24.29 62.39,24.29 61.91,23.81 DB8.C 61.75,23.81 56.2,23.81 55.72,24.29 54.45,24.29 53.98,23.81 DB7.C 53.82,23.81 53.34,24.29 46.51,24.29 46.04,23.81 DB6.C 45.88,23.65 44.77,23.65 41.91,20.8 41.91,20.48 41.43,20 39.37,20 37.94,21.43 37.94,23.65 DB5.C 37.78,23.81 32.07,23.81 31.59,24.29 30.48,24.29 30,23.81 DB4.C 29.84,23.81 29.69,23.97 24.61,23.97 23.81,23.18 22.7,23.18 | 13.81,20.32 13.49,20 10.79,20 9.84,20.95 9.84,22.07 7.62,24.29 6.51,24.29 6.03,23.81 DB1.C 5.87,23.65 5.87,19.84 v4.76,18.73 | 13.81,20.32 13.81,23.65 DB2.C | 22.7,23.18 22.23,23.65 21.91,23.65 DB3.C | 13.81,20.32 15.08,20.32 15.4,20 17.46,20 18.26,20.8 19.37,20.8 20.16,20 21.59,20 22.7,21.11 22.7,23.18 | 68.1,43.5 69.06,42.55 69.06,35.24 66.83,33.02 v64.77,33.02
  Bottom 0.152: v64.14,23.97 v64.14,25.24 64.45,25.56 64.45,32.7 v64.77,33.02 | v4.76,18.73 4.76,17.14 5.87,17.14 U$1.P$34
KEYROW2  (via drill 0.33)
  Top 0.152: 73.34,16.35 77.31,16.35 77.79,15.88 DC10.C | 73.34,16.35 70.8,16.35 70.33,15.88 70.01,15.88 DC9.C 69.85,15.88 64.14,15.88 63.66,16.35 62.39,16.35 61.91,15.88 DC8.C 61.75,15.88 56.04,15.88 55.56,16.35 54.45,16.35 53.98,15.88 DC7.C 53.82,15.88 53.34,16.35 46.83,16.35 46.35,15.88 46.04,15.88 DC6.C 45.88,15.88 40.01,15.88 39.53,16.35 38.42,16.35 37.94,15.88 DC5.C 37.78,15.88 32.07,15.88 31.59,16.35 30.48,16.35 30,15.88 DC4.C 29.84,15.88 29.37,16.35 22.86,16.35 22.38,15.88 21.91,15.88 DC3.C 21.75,15.88 v17.78,15.88 | 73.34,16.35 73.34,39.21 DC11.C | 7.14,16.35 12.7,16.35 13.18,15.88 13.81,15.88 DC2.C 13.97,15.88 14.29,15.88 14.76,16.35 15.56,16.35 17.78,14.13 v17.78,13.97 | 7.14,16.35 6.83,16.35 6.35,15.88 6.03,15.88 DC1.C | 7.14,16.35 v7.14,16.51
  Bottom 0.152: v7.14,16.51 6.03,16.51 U$1.P$33 | v17.78,15.88 v17.78,13.97
KEYROW3  (via drill 0.33)
  Top 0.152: 77.31,8.26 70.48,8.26 70.01,7.78 DD9.C 69.85,7.78 64.14,7.78 63.66,8.26 62.39,8.26 61.91,7.78 DD8.C 61.75,7.78 56.2,7.78 55.72,8.26 54.45,8.26 53.98,7.78 DD7.C 53.82,7.78 53.34,8.26 46.51,8.26 46.04,7.78 DD6.C 45.88,7.78 45.4,8.26 38.73,8.26 38.26,7.78 37.94,7.78 DD5.C 37.78,7.78 37.78,8.1 35.4,10.48 31.43,10.48 30,9.05 30,7.78 DD4.C 29.84,7.62 28.73,7.62 25.08,3.97 23.5,3.97 21.91,5.56 21.91,7.62 DD3.C 21.75,7.78 16.19,7.78 15.72,8.26 14.45,8.26 13.97,7.78 DD2.C 13.81,7.78 13.34,8.26 10.97,8.26 | 77.31,8.26 77.79,7.78 DD10.C | 77.31,8.26 78.58,9.53 78.58,21.91 77.31,23.18 77.31,24.13 77.63,24.45 77.63,30.96 77.31,31.27 77.31,37.94 80.8,41.43 80.8,43.18 80.33,43.66 80.33,43.97 DD11.C | 10.97,8.26 6.51,8.26 6.03,7.78 DD1.C | v7.14,17.46 6.67,17.46 5.24,16.03 5.24,15.24 5.71,14.76 5.71,11.11 7.61,11.11 7.7,11.02 10.62,11.02 10.97,10.67 10.97,8.26
  Bottom 0.152: U$1.P$30 8.89,14.61 8.89,15.72 v7.14,17.46 6.03,17.46 U$1.P$35
N$1  (via drill 0.33)
  Top 0.152: v18.89,5.4 18.89,4.76 v20,3.65
  Bottom 0.152: U$4.P11 20,5.71 19.68,5.71 U$4.P12 19.53,5.56 18.89,5.56 v18.89,5.4 | v20,3.65 20.64,3.02 20.64,2.38 U$5.P$2
N$2
  Bottom 0.152: U$4.P5 21.43,8.26 21.43,9.53 22.23,10.32 22.23,10.64 R1.1 22.38,10.64 22.38,8.89 24.13,7.14 R2.2
N$3  (via drill 0.33)
  Top 0.152: v33.34,4.76 33.34,5.87 v36.2,8.73
  Bottom 0.152: v33.34,4.76 33.34,5.4 33.02,5.71 R3.1 | v36.2,8.73 36.2,7.46 X1.21
N$4
  Bottom 0.152: U$4.P3 20.48,8.26 20.48,10.16 20.95,10.64 R1.2
N$5
  Bottom 0.152: C10.2 36.67,5.56 36.67,7.3 X1.22
N$6
  Bottom 0.152: 19.68,8.26 U$4.P1 19.65,8.69 19.36,8.99 19.36,9.47 19.32,9.51 19.32,12.91 19.64,13.23 | 19.64,13.23 19.68,13.18 | 19.64,13.23 C3.1
N$7
  Bottom 0.152: U$6.A1 4.6,9.05 2.06,6.51 1.43,6.51 L1.1
N$8
  Top 0.152: DA1.A 7.3,31.75 7.3,31.11 8.1,30.32 BTA1.P$3
N$9
  Top 0.152: DA2.A 15.24,31.75 15.24,31.11 16.03,30.32 BTA2.P$3
N$10
  Top 0.152: DA3.A 23.34,31.75 23.34,31.11 24.13,30.32 BTA3.P$3
N$11
  Top 0.152: DA4.A 31.27,31.75 31.27,31.11 32.07,30.32 BTA4.P$3
N$12
  Top 0.152: DA5.A 39.21,31.27 40.16,30.32 BTA5.P$3
N$13
  Top 0.152: DA6.A 47.31,31.75 47.31,31.11 48.1,30.32 BTA6.P$3
N$14
  Top 0.152: DA7.A 55.24,31.75 55.24,31.11 56.04,30.32 BTA7.P$3
N$15
  Top 0.152: DA8.A 63.34,31.75 63.34,31.11 64.14,30.32 BTA8.P$3
N$16
  Top 0.152: DA9.A 71.28,31.75 71.28,31.11 72.07,30.32 BTA9.P$3
N$17
  Top 0.152: DA10.A 79.22,31.75 79.22,31.27 80.17,30.32 BTA10.P$3
N$18
  Top 0.152: BTA11.P$3 73.5,47.15 73.5,47.62 DA11.A
N$19
  Top 0.152: DB1.A 7.3,23.65 7.3,23.02 8.1,22.23 BTB1.P$3
N$20
  Top 0.152: DB2.A 15.24,23.65 15.24,23.02 16.03,22.23 BTB2.P$3
N$21
  Top 0.152: DB3.A 23.18,23.81 22.86,23.81 22.38,24.29 21.43,24.29 20.95,23.81 20.95,22.23 BTB3.P$1
N$22
  Top 0.152: DB4.A 31.27,23.65 31.27,23.02 32.07,22.23 BTB4.P$3
N$23
  Top 0.152: DB5.A 39.21,23.65 39.21,23.18 BTB5.P$3
N$24
  Top 0.152: DB6.A 47.31,23.65 47.31,23.02 48.1,22.23 BTB6.P$3
N$25
  Top 0.152: DB7.A 55.24,23.65 55.24,23.02 56.04,22.23 BTB7.P$3
N$26
  Top 0.152: DB8.A 63.34,23.65 63.34,23.02 64.14,22.23 BTB8.P$3
N$27
  Top 0.152: DB9.A 71.28,23.65 71.28,23.02 72.07,22.23 BTB9.P$3
N$28
  Top 0.152: DB10.A 79.22,23.65 79.22,23.18 BTB10.P$3
N$29
  Top 0.152: DB11.A 65.41,44.29 65.88,44.29 66.67,45.09 BTB11.P$3
N$30
  Top 0.152: DC1.A 7.3,15.72 7.3,15.08 8.1,14.29 BTC1.P$3
N$31
  Top 0.152: DC2.A 15.24,15.72 15.24,15.08 16.03,14.29 BTC2.P$3
N$32
  Top 0.152: DC3.A 23.34,15.72 23.34,15.08 24.13,14.29 BTC3.P$3
N$33
  Top 0.152: DC4.A 31.27,15.72 31.27,15.08 32.07,14.29 BTC4.P$3
N$34
  Top 0.152: DC5.A 39.21,15.72 39.21,15.24 40.16,14.29 BTC5.P$3
N$35
  Top 0.152: DC6.A 47.31,15.72 47.31,15.08 48.1,14.29 BTC6.P$3
N$36
  Top 0.152: DC7.A 55.24,15.72 55.24,15.08 56.04,14.29 BTC7.P$3
N$37
  Top 0.152: DC8.A 63.34,15.72 63.34,15.08 64.14,14.29 BTC8.P$3
N$38
  Top 0.152: DC9.A 71.28,15.72 71.28,15.08 72.07,14.29 BTC9.P$3
N$39
  Top 0.152: DC10.A 79.22,15.72 79.22,15.24 80.17,14.29 BTC10.P$3
N$40
  Top 0.152: DC11.A 71.91,39.37 71.91,39.85 71.12,40.64 BTC11.P$3
N$41
  Top 0.152: DD1.A 7.3,7.62 7.3,7.14 8.1,6.35 BTD1.P$3
N$42
  Top 0.152: DD2.A 15.24,7.62 15.24,7.14 16.03,6.35 BTD2.P$3
N$43
  Top 0.152: DD3.A 23.34,7.62 23.34,7.14 24.13,6.35 BTD3.P$3
N$44
  Top 0.152: DD4.A 31.27,7.62 31.27,7.14 32.07,6.35 BTD4.P$3
N$45
  Top 0.152: DD5.A 39.21,7.62 39.21,7.3 40.16,6.35 BTD5.P$3
N$46
  Top 0.152: DD6.A 47.31,7.62 47.31,7.14 48.1,6.35 BTD6.P$3
N$47
  Top 0.152: DD7.A 55.24,7.62 55.24,7.14 56.04,6.35 BTD7.P$3
N$48
  Top 0.152: DD8.A 63.34,7.62 63.34,7.14 64.14,6.35 BTD8.P$3
N$49
  Top 0.152: DD9.A 71.28,7.62 71.28,7.14 72.07,6.35 BTD9.P$3
N$50
  Top 0.152: DD10.A 79.22,7.62 79.22,7.3 80.17,6.35 BTD10.P$3
N$51
  Top 0.152: DD11.A 80.17,42.7 79.53,42.7 78.74,41.91 BTD11.P$3
N$52  (via drill 0.33)
  Top 0.152: v18.57,22.23 18.89,22.23 21.27,24.61 v23.65,24.61
  Bottom 0.152: C13.1 23.65,27.94 23.65,26.19 U$7.P$1 23.65,26.04 v23.65,24.61 | v18.57,22.23 18.57,22.07 17.46,22.07 U$1.P$5
N$53
  Bottom 0.152: 21.75,21.59 21.75,22.54 U$7.P$3 | 21.75,21.59 21.75,20.8 C14.1 | 21.75,21.59 U$1.P$6
N$54  (via drill 0.33)
  Top 0.152: v68.9,50.16 68.9,49.53 v67.31,47.94
  Bottom 0.152: U$3.P$1 75.72,49.05 75.72,43.66 70.01,43.66 68.74,44.93 68.74,46.67 67.63,46.67 67.31,46.99 U$8.P$6 67.31,47.15 v67.31,47.94 | v68.9,50.16 68.9,49.05 C15.1
N$55
  Bottom 0.152: U$8.P$1 69.53,47.15 71.12,47.15 R5.1
N$56  (via drill 0.33)
  Top 0.152: v67.15,43.97 66.04,43.97 65.56,43.5 64.93,43.5 64.77,43.66 64.77,44.93 v65.09,45.24
  Bottom 0.152: v67.15,43.97 67.15,45.09 U$8.P$4 | v65.09,45.24 65.09,46.04 R4.1
N$57  (via drill 0.33)
  Top 0.152: v1.43,48.58 1.43,47.78 LED1.A
  Bottom 0.152: v1.43,48.58 1.43,47.62 R11.2
N$58  (via drill 0.33)
  Top 0.152: v2.06,45.09 2.7,45.72 2.7,47.62 LED1.C | v2.06,31.27 3.97,29.37 3.97,28.42 3.65,28.1 v3.65,20.95
  Bottom 0.152: v2.06,31.27 v2.06,45.09 | v3.65,20.95 4.76,22.07 5.87,22.07 U$1.P$44
N$60  (via drill 0.33)
  Top 0.152: v1.43,43.02 1.59,43.02 2.54,43.97 2.86,43.97 LED2.A
  Bottom 0.152: v1.43,43.02 1.43,43.97 R12.2
N$62
  cutout Top: 4,48.2 4,36.8 13.5,36.8 60,36.8 60,45.4 60,50.5 5.4,50.5 4,50.5
N$63
  cutout Bottom: 4,49.7 4,44.8 4,36.8 58.9,36.8 60,36.8 60,50 60,50.5 5.3,50.5 4,50.5
NRST  (via drill 0.33)
  Top 0.152: v5.87,34.29 5.87,32.7 5.24,32.07 5.24,31.27 5.71,30.8 5.71,27.78 v11.27,22.23 | v11.91,19.37 17.78,19.37 v18.57,20.16
  Bottom 0.152: 18.57,19.68 18.41,19.84 18.41,20.8 18.1,21.11 17.46,21.11 U$1.P$7 | 18.57,19.68 18.89,19.37 R10.1 | v5.87,34.29 6.83,34.29 7.46,34.92 TP6.TP | v11.27,22.23 11.91,21.59 v11.91,19.37 | 18.57,19.68 v18.57,20.16
PA3  (via drill 0.33)
  Top 0.152: v15.88,10.64 28.89,10.64 v29.53,10
  Bottom 0.152: v15.88,10.64 15.88,14.13 15.56,14.45 U$1.P$17 | v29.53,10 30.64,8.89 30.64,7.46 X1.10
PA13  (via drill 0.33)
  Top 0.152: v6.83,29.21 6.83,31.11 6.51,31.43 6.51,32.07 9.05,34.61 v14.13,34.61
  Bottom 0.152: v6.83,29.21 7.14,28.89 7.14,23.18 6.03,23.18 U$1.P$46 | v14.13,34.61 13.81,34.92 12.7,34.92 TP2.TP
PA14
  Bottom 0.152: U$1.P$49 7.94,26.19 7.94,30.32 10,32.38 TP3.TP
SD_CLK  (via drill 0.33)
  Top 0.152: v19.37,28.73 20.48,27.62 41.27,27.62 43.97,30.32 43.97,30.8 44.29,31.11 45.4,31.11 47.31,29.21 47.31,28.1 47.78,27.62 v63.82,27.62
  Bottom 0.152: v19.37,28.73 19.37,30.8 12.38,30.8 10,28.42 10,26.19 U$1.P$53 | v63.82,27.62 64.14,27.94 64.14,35.88 63.98,36.04 63.98,36.67 64.29,36.99 67.79,36.99 U$2.P$5
SD_CMD  (via drill 0.33)
  Top 0.152: v18.41,28.57 18.41,29.05 20,30.64 20,30.96 20.16,31.11 22.23,31.11 22.54,31.43 22.54,32.07 22.86,32.38 28.26,32.38 v28.57,32.07 | v28.57,34.29 33.97,34.29 35.08,35.4 66.04,35.4 v66.67,34.77
  Bottom 0.152: v18.41,28.57 18.41,30.48 12.54,30.48 10.32,28.26 10.32,27.62 10.48,27.46 10.48,26.19 U$1.P$54 | v66.67,34.77 67.79,34.77 U$2.P$3 | v28.57,34.29 v28.57,32.07
SD_DAT0  (via drill 0.33)
  Top 0.152: v7.14,19.53 10.79,19.53 12.54,17.78 67.63,17.78 v69.53,19.68
  Bottom 0.152: v7.14,19.53 6.03,19.53 U$1.P$39 | v69.53,19.68 69.06,20.16 69.06,38.1 67.94,39.21 U$2.P$7
SD_DAT1  (via drill 0.33)
  Top 0.152: v4.76,19.68 3.97,19.68 v0.95,22.7 | v0.95,46.04 2.06,47.15 2.06,49.53 3.81,51.28 60.17,51.28 64.45,46.99 64.45,42.7 v66.67,40.48
  Bottom 0.152: v4.76,19.68 4.76,20 5.87,20 U$1.P$40 | v0.95,22.7 0.79,22.86 0.79,45.88 v0.95,46.04 | v66.67,40.48 67.79,40.48 67.79,40.32 U$2.P$8
SD_DAT2  (via drill 0.33)
  Top 0.152: v8.89,27.62 8.89,27.94 9.05,28.1 9.05,29.84 13.18,33.97 20,33.97 22.07,36.04 64.29,36.04 v64.61,36.35
  Bottom 0.152: v8.89,27.62 8.89,26.19 U$1.P$51 | v64.61,36.35 64.93,36.04 64.93,34.61 66.99,32.54 67.79,32.54 U$2.P$1
SD_DAT3  (via drill 0.33)
  Top 0.152: v9.68,29.53 13.81,33.66 20.16,33.66 22.23,35.72 66.67,35.72 67.31,35.08 67.31,34.45 v66.67,33.81
  Bottom 0.152: v9.68,29.53 9.53,29.37 9.53,26.19 U$1.P$52 | v66.67,33.81 67.79,33.81 67.79,33.66 U$2.P$2
SD_SWITCH  (via drill 0.33)
  Top 0.152: v8.57,18.89 10.95,18.89 12.38,17.46 71.12,17.46 v72.71,19.05
  Bottom 0.152: R8.2 78.42,44.93 78.42,42.23 U$2.P$10 78.26,42.07 78.26,24.61 v72.71,19.05 | v8.57,18.89 8.57,26.04 U$1.P$50
SPI_CS  (via drill 0.33)
  Top 0.152: v16.03,24.29 20.48,24.29 21.43,25.24 28.42,25.24 v29.05,24.61 | v31.27,8.89 30.48,8.1 30.48,6.67 v30,6.19
  Bottom 0.152: v16.03,24.29 16.03,18.1 13.97,16.03 13.97,14.61 U$1.P$20 | v29.05,24.61 29.05,11.43 31.27,9.21 v31.27,8.89 | v30,6.19 29.69,6.51 29.69,7.3 X1.8
SPI_MOSI  (via drill 0.33)
  Top 0.152: v12.86,11.43 13.18,11.43 15.56,9.05 v25.08,9.05 | v26.35,9.05 29.53,9.05 31.27,10.79 32.7,10.79 v33.02,11.11
  Bottom 0.152: v12.86,11.43 12.38,11.91 12.38,14.45 U$1.P$23 | v26.35,9.05 v25.08,9.05 | v33.02,11.11 32.86,10.95 32.86,7.46 X1.14
SPI_SCK  (via drill 0.33)
  Top 0.152: v13.49,16.51 14.45,16.51 14.61,16.67 32.23,16.67 v32.38,16.51
  Bottom 0.152: v13.49,16.51 13.49,14.61 U$1.P$21 | v32.38,16.51 32.38,8.26 32.23,8.1 32.23,7.46 X1.13
V+  (via drill 0.33)
  Top 0.152: v9.68,4.76 10.79,4.76 14.61,0.95 v33.5,0.95 77.79,0.95 81.76,4.92 81.76,44.61 77.47,48.9 71.75,48.9 70.48,47.62 v68.58,47.62
  Bottom 0.152: 72.07,45.72 72.55,45.72 72.55,45.4 73.34,44.61 C16.1 | 72.07,45.72 69.85,45.72 69.53,46.04 U$8.P$2 | v9.68,4.76 8.73,4.76 U$9.P$1 | v33.5,0.95 34.77,2.22 34.77,2.38 TP7.TP | 72.07,45.72 72.07,47.47 71.75,47.78 68.58,47.78 v68.58,47.62
VCC  (via drill 0.33)
  Top 0.152: v9.45,10.36 7.96,8.57 v5.71,8.57 3.77,8.57 v3.2,9.14
  Bottom 0.152: 21.43,4.29 21.43,3.49 22.54,2.38 U$5.P$1 22.7,2.38 26.67,2.38 C1.1 | 21.43,4.29 21.43,5.56 U$4.P8 | U$6.D2 5.08,10.32 4.76,10.32 U$6.D1 4.6,10.32 4.6,10 U$6.C1 4.6,9.84 4.6,9.53 U$6.B1 3.56,9.5 v3.2,9.14 | 8.26,10.32 C11.1 8.47,10.36 v9.45,10.36 | 11.59,5.87 11.59,4.92 U$9.P$3 11.75,4.76 13.49,4.76 16.03,2.22 C17.1 16.19,2.22 17.3,3.33 17.3,4.29 21.43,4.29 | 5.08,9.05 U$6.A2 5.18,9.1 v5.71,8.57 5.79,8.5 5.79,7.32 7.23,5.87 11.59,5.87 | 11.59,5.87 11.59,8.26 12.38,9.05 R6.2
VCC/2  (via drill 0.33)
  Top 0.152: v17.3,6.19 17.3,5.4 19.68,3.02 36.51,3.02 37.94,4.45 v37.94,6.03 | v19.9,9.75 v18.59,9.75
  Bottom 0.152: C19.2 35.56,19.68 37.15,18.1 37.15,7.46 X1.23 37.31,7.3 37.31,6.67 v37.94,6.03 | 17.3,8.08 v17.3,6.19 | 17.3,8.08 17.3,8.1 C2.1 | U$4.P2 20.1,9.62 19.96,9.75 v19.9,9.75 | v18.59,9.75 18.59,8.23 18.44,8.08 17.3,8.08

### Text on the board
bNames: PA13 | GND | RST / 3v3 | PA14 | BOOT | Giuliano Scaglioni / May 2017 | +